# Altium schematic sheet 51-2001-01-14_04 Power Module Schematic.SchDoc
size 431 x 279 mm; Organization: ORGANIZATION; Address1: ADDRESS 1; Address2: ADDRESS 2; Address3: ADDRESS 3; Address4: ADDRESS 4; Revision: -; SheetNumber: 4; SheetTotal: 4; ENG_APP_DATE: --/--/--; DSN_APP_DATE: --/--/--; CHK_APP_DATE: --/--/--
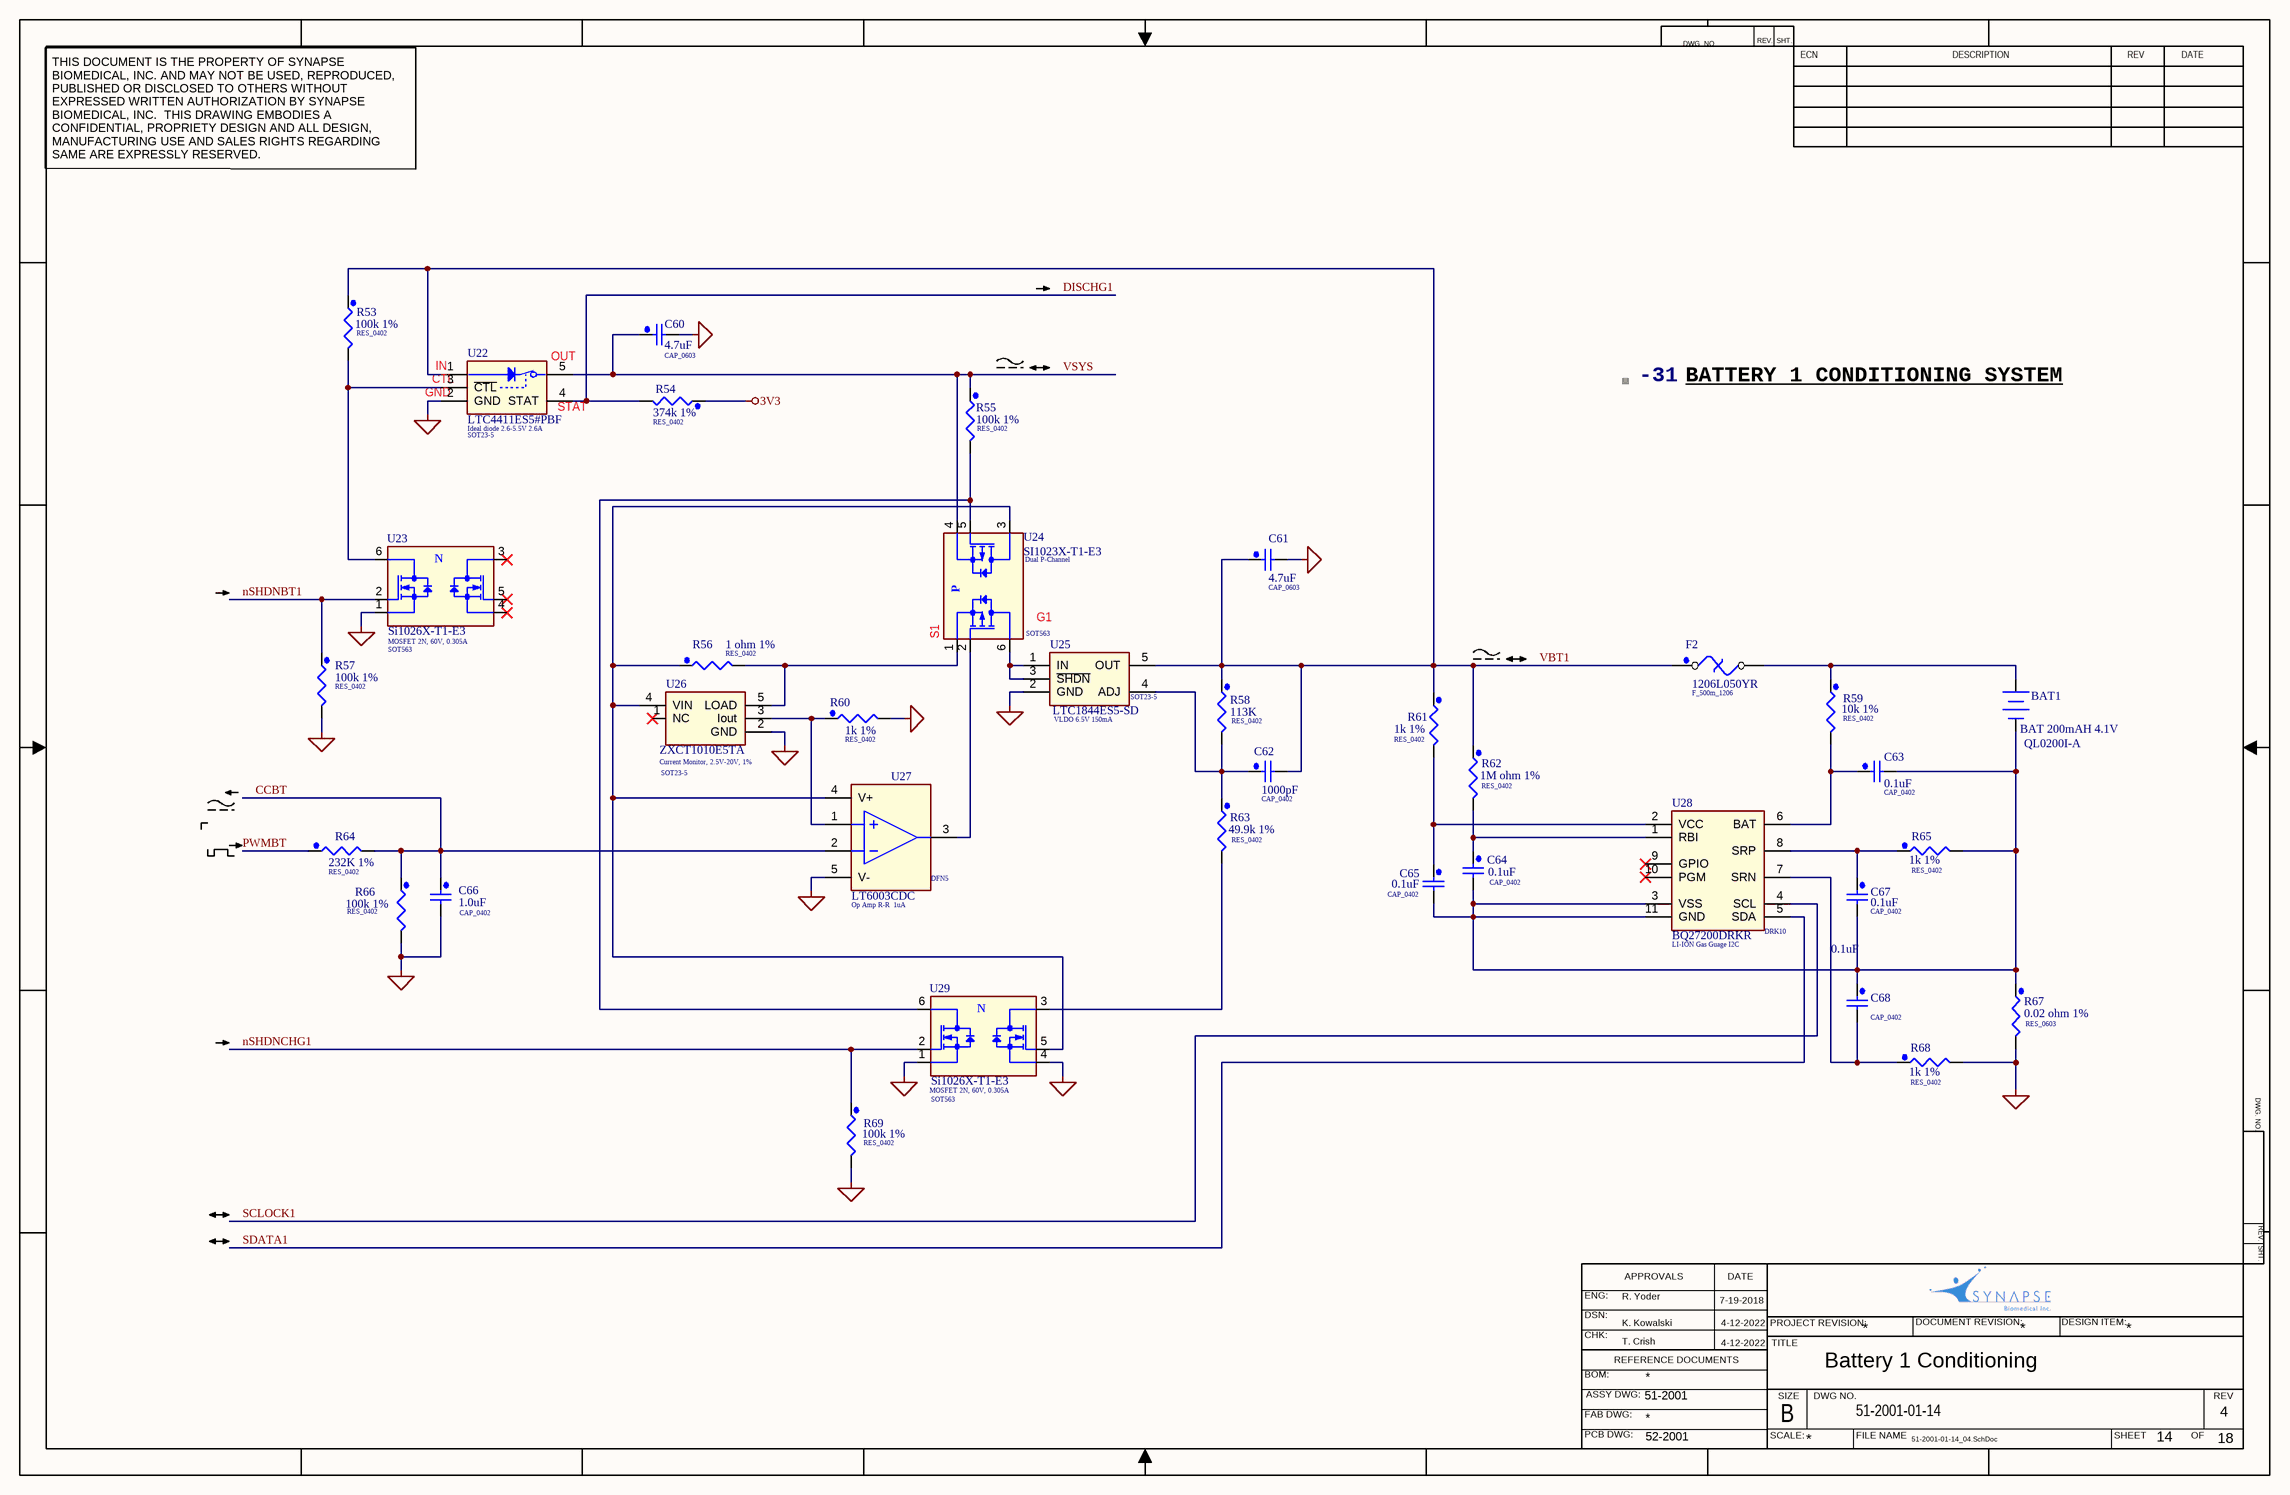
[diagram p0: 51-2001-01-14_04 Power Module Schematic.SchDoc]

## Parts
-31  XDESCRIPTION: BATTERY 1 CONDITIONING SYSTEM  (hidden comment: BOM_S1)  (graphical)
BAT1  BAT 200mAH 4.1V  [QL0200I-A]  (no BOM)
C60  value 4.7uF  [CAP_0603]  (hidden comment: C_4u7_X5R_10_0603_10%)
C61  value 4.7uF  [CAP_0603]  (hidden comment: C_4u7_X5R_10_0603_10%)
C62  value 1000pF  [CAP_0402]  (hidden comment: C_1n_C0G_50_0402_5%)
C63  value 0.1uF  [CAP_0402]  (hidden comment: C_100n_X7R_16_0402_10%)
C64  value 0.1uF  [CAP_0402]  (hidden comment: C_100n_X7R_16_0402_10%)
C65  value 0.1uF  [CAP_0402]  (hidden comment: C_100n_X7R_16_0402_10%)
C66  value 1.0uF  [CAP_0402]  (hidden comment: C_1u_X5R_6V3_0402_20%)
C67  value 0.1uF  [CAP_0402]  (hidden comment: C_100n_X7R_16_0402_10%)
C68  value 0.1uF  [CAP_0402]  (hidden comment: C_100n_X7R_16_0402_10%)
F2  F_500m_1206  [FUSE_1206]
R53  value 100k 1%  [RES_0402]  (hidden comment: R_100k_0402)
R54  value 374k 1%  [RES_0402]  (hidden comment: R_374k_0402)
R55  value 100k 1%  [RES_0402]  (hidden comment: R_100k_0402)
R56  value 1 ohm 1%  [RES_0402]  (hidden comment: R_1_0402)
R57  value 100k 1%  [RES_0402]  (hidden comment: R_100k_0402)
R58  value 113K  [RES_0402]  (hidden comment: R_113k_0402)
R59  value 10k 1%  [RES_0402]  (hidden comment: R_10k_0402)
R60  value 1k 1%  [RES_0402]  (hidden comment: R_1k_0402)
R61  value 1k 1%  [RES_0402]  (hidden comment: R_1k_0402)
R62  value 1M ohm 1%  [RES_0402]  (hidden comment: RES_0402)
R63  value 49.9k 1%  [RES_0402]  (hidden comment: R_49k9_0402)
R64  value 232K 1%  [RES_0402]  (hidden comment: R_232k_0402)
R65  value 1k 1%  [RES_0402]  (hidden comment: R_1k_0402)
R66  value 100k 1%  [RES_0402]  (hidden comment: R_100k_0402)
R67  value 0.02 ohm 1%  [RES_0603]  (hidden comment: R_20m_0603)
R68  value 1k 1%  [RES_0402]  (hidden comment: R_1k_0402)
R69  value 100k 1%  [RES_0402]  (hidden comment: R_100k_0402)
U22  Ideal diode 2.6-5.5V 2.6A  MPN: LTC4411ES5#PBF  [SOT23-5]
U23  MOSFET 2N, 60V, 0.305A  PackageDescription: SOT563  [SOT-563]
U24  Dual P-Channel  PackageDescription: SOT563  [SOT-563]
U25  VLDO 6.5V 150mA  [SOT23-5]
U26  Current Monitor, 2.5V-20V, 1%  [SOT23-5]
U27  Op Amp R-R  1uA  PackageDescription: DFN5  [DFN4]
U28  LI-ION Gas Guage I2C  PackageDescription: DRK10  [QFN10]
U29  MOSFET 2N, 60V, 0.305A  PackageDescription: SOT563  [SOT-563]

## Nets
3V3: R54.1
GND: C60.2 C61.2 C66.2 R57.2 R60.2 R66.2 R67.2 R68.2 R69.2 U22.2(GND) U23.1(S1) U25.2(GND) U26.2(GND) U27.5(V-) U29.1(S1) U29.4(S2)
CCBT: C66.1 R64.2 R66.1 U27.2(-IN)
DISCHG1: R54.2 U22.4(STAT)
nSHDNBT1: R57.1 U23.2(G1)
nSHDNCHG1: R69.1 U29.2(G1)
PWMBT: R64.1
SCLOCK1: U28.4(SCL)
SDATA1: U28.5(SDA)
VBT1: C61.1 C62.2 F2.1 R53.1 R58.1 R61.1 R62.1 U22.1(IN) U25.5(OUT)
VSYS: C60.1 R55.1 U22.5(OUT) U24.4(S2)
NetBAT1_1: BAT1.1(+) F2.2 R59.1
NetBAT1_2: BAT1.2(-) C63.2 C64.2 C65.2 C67.2 C68.1 R65.2 R67.1 U28.3(VSS) U28.11(GND)
NetC62_1: C62.1 R58.2 R63.1 U25.4(ADJ)
NetC63_1: C63.1 R59.2 U28.6(BAT)
NetC64_1: C64.1 R62.2 U28.1(RBI)
NetC65_1: C65.1 R61.2 U28.2(VCC)
NetC67_1: C67.1 R65.1 U28.8(SRP)
NetC68_2: C68.2 R68.1 U28.7(SRN)
NetR53_2: R53.2 U22.3(~{CTL}) U23.6(D1)
NetR55_2: R55.2 U24.5(G2) U29.6(D1)
NetR56_1: R56.1 U24.3(D2) U26.4(VIN) U27.4(V+) U29.5(G2)
NetR56_2: R56.2 U24.1(S1) U26.5(LOAD)
NetR60_1: R60.1 U26.3(Iout) U27.1(+IN)
NetR63_2: R63.2 U29.3(D2)
NetU24_2: U24.2(G1) U27.3(OUT_A)
NetU24_6: U24.6(D1) U25.1(IN) U25.3(~{SHDN})

Not connected (* = marked no-connect by the designer): U23 3(D2)* 4(S2)* 5(G2)*; U26 1(NC)*; U28 9(GPIO)* 10(PGM)*

## Notes on the sheet
- DWG. NO.
- REV.
- SHT.
- ECN
- DESCRIPTION
- REV
- DATE
- THIS DOCUMENT IS THE PROPERTY OF SYNAPSE BIOMEDICAL, INC. AND MAY NOT BE USED, REPRODUCED, PUBLISHED OR DISCLOSED TO OTHERS WITHOUT EXPRESSED WRITTEN AUTHORIZATION BY SYNAPSE BIOMEDICAL, INC.  THIS DRAWING EMBODIES A CONFIDENTIAL, PROPRIETY DESIGN AND ALL DESIGN, MANUFACTURING USE AND SALES RIGHTS REGARDING SAME ARE EXPRESSLY RESERVED.
- (near U22) IN
- (near U22) OUT
- (near U22) GND
- (near U22) CTL
- (near U22) STAT
- (near U24) S1
- G1
- ENG:
- R. Yoder
- APPROVALS
- 7-19-2018
- DSN:
- CHK:
- REFERENCE DOCUMENTS
- K. Kowalski
- T. Crish
- 4-12-2022
- PROJECT REVISION:
- TITLE
- Battery 1 Conditioning
- *
- DOCUMENT REVISION:
- DESIGN ITEM:
- BOM:
- FAB DWG:
- PCB DWG:
- ASSY DWG:
- 51-2001
- SCALE:
- SIZE
- B
- DWG NO.
- 51-2001-01-14
- FILE NAME
- SHEET
- OF
- 4
- 52-2001
- 51-2001-01-14_04.SchDoc
- 14
- 18
- (in symbol SI1023X-T1-E3) P
- (in symbol Si1026X-T1-E3) N

## Library data of the parts
-31 = BOM_S1: BOM item small graphic
BAT1 = QL0200I-A: Li-ion battery 200mAH 4.1V; MFR: Quallion; Value: 200mAH 4.1V; Supplier 1: Quallion; Supplier Part Number 1: QL0200I-A; MPN: QL0200I-A
C60 C61 = LMK107BJ475KA-T: 4.7uF, 10V, X5R, 10%, 0603, RoHS; MFR: Murata Electronics North America; MPN: GRM185R61A475KE11D; SBI: 53-0076; PackageDescription: CAP_0603; Supplier 1: Digi-Key; Supplier Part Number 1: 490-11988-6-ND
C62 = GRM1555C1H102JA01D: 1000pF, 50V, C0G, 5%, 0402, RoHS; MFR: Murata; SBI: 53-0041-2; PackageDescription: CAP_0402; Supplier 1: Digi-Key; Supplier Part Number 1: 490-3244-1-ND; MPN: GRM1555C1H102JA01D
C63-C65 C67 C68 = GRM155R71C104KA88D: 0.1uF, 16V, X7R, 0402, RoHS; MFR: Murata; SBI: 53-0040-1; PackageDescription: CAP_0402; Supplier 1: Digi-Key; Supplier Part Number 1: 490-3261-2-ND; MPN: GRM155R71C104KA88D
C66 = ECJ-0EB0J105M: 1.0uF, 6.3V, X5R, 20%, 0402, RoHS; MFR: Murata Electronics North America; MPN: GRM152R60J105ME15D; SBI: 53-0078; PackageDescription: CAP_0402; Supplier 1: Digi-Key; Supplier Part Number 1: 490-10006-6-ND
F2 = 1206L050YR: PTC Resettable, 500mA, 0.4 ohm,  6V, 1206, RoHS; MFR: Littelfuse; SBI: 54-0113; PackageDescription: F_500m_1206; Supplier 1: Digi-Key; Supplier Part Number 1: F2112CT-ND; Value: 500mA; MPN: 1206L050YR
R53 R55 R57 R66 R69 = MCR01MZPF1003: 100k ohm, 1%, 1/16W, smd, 0402, RoHS; MFR: Vishay Dale; MPN: CRCW0402100KFKED; SBI: 53-0049-7; PackageDescription: RES_0402; Supplier 1: Digi-Key; Supplier Part Number 1: 541-100KLDKR-ND
R54 = CRCW0402374KFKED: 374k ohm, 1%, 1/16W, 0402,RoHS; MFR: Vishay Dale; SBI: 53-0049-25; PackageDescription: RES_0402; Supplier 1: Digi-Key; Supplier Part Number 1: 541-374KLDKR-ND; MPN: CRCW0402374KFKED
R56 = CRCW04021R00FNED: 1.0 ohm, 1%, 1/16W, 0402, RoHS; MFR: Vishay; PackageDescription: RES_0402; Supplier 1: Digi-Key; Supplier Part Number 1: 541-1.00LCT-ND; MPN: CRCW04021R00FNED
R58 = ERJ-2RKF1133X: 113k ohm, 1%, 1/16W, 0402, RoHS; MFR: Vishay Dale; MPN: CRCW0402113KFKED; SBI: 53-0049-33; PackageDescription: RES_0402; Supplier 1: Digi-Key; Supplier Part Number 1: 541-113KLDKR-ND
R59 = MCR01MZPF1002: 10.0k ohm, 1%, 1/16W, smd, 0402, RoHS; MFR: Vishay Dale; MPN: CRCW040210K0FKED; PackageDescription: RES_0402; Supplier 1: Digi-Key; Supplier Part Number 1: 541-10.0KLDKR-ND
R60 R61 R65 R68 = MCR01MZPF1001: 1.0k ohm 1% 1/16W smd 0402 RoHS; MFR: Vishay Dale; MPN: CRCW04021K00FKED; SBI: 53-0049-4; PackageDescription: RES_0402; Supplier 1: Digi-Key; Supplier Part Number 1: 541-1.00KLDKR-ND
R62 = MCR01MZPF1004: 1M ohm, 1/16W, 1%, 0402, RoHS; MFR: Vishay Dale; MPN: CRCW04021M00FKED; SBI: 53-0095; PackageDescription: RES_0402; Supplier 1: Digi-Key; Supplier Part Number 1: 541-1.00MLDKR-ND
R63 = MCR01MZPF4992: 49.9k ohm, 1%, 1/16W, 0402, RoHS; MFR: Vishay Dale; MPN: CRCW040249K9FKED; SBI: 53-009-2; PackageDescription: RES_0402; Supplier 1: Digi-Key; Supplier Part Number 1: 541-49.9KLDKR-ND
R64 = CRCW0402232KFKED: 232k, 1%, 1/16W, 0402, RoHS; MFR: Vishay Dale; SBI: 53-0049-34; PackageDescription: RES_0402; Supplier 1: Digi-Key; Supplier Part Number 1: 541-232KLDKR-ND; MPN: CRCW0402232KFKED
R67 = WSL0603R0200FEA: 0.02 ohm, 1%, 1/10W, 0603, RoHS; MFR: Vishay Dale; SBI: 53-0087; PackageDescription: RES_0603; Supplier 1: Digi-Key; Supplier Part Number 1: WSLJ-.02DKR-ND; MPN: WSL0603R0200FEA
U22 = LTC4411ES5: Ideal diode, 2.6-5.5V, 2.6A, SOT23-5, RoHS; MFR: Linear Technology; SBI: 54-0101; Supplier 1: Digi-Key; Supplier Part Number 1: LTC4411ES5#TRMPBFDKR-ND; PackageDescription: SOT23-5
U23 U29 = Si1026X-T1-E3: MOSFET 2N, 60V, 0.305A, RoHS; MFR: Vishay Siliconix; Value: 500mA; SBI: 54-0102; Supplier 1: Digi-Key; Supplier Part Number 1: SI1026X-T1-E3CT-ND; MPN: Si1026X-T1-E3
U24 = SI1023X-T1-E3: Dual P-Channel Mosfet, SOT563, RoHS; MFR: Vishay Siliconix; Value: -350mA; SBI: 54-0103; Supplier 1: Digi-Key; Supplier Part Number 1: SI1023X-T1-GE3CT-ND; MPN: SI1023X-T1-E3
U25 = LTC1844ES5-SD: VLDO, 150mA, SOT23-5, RoHS; MFR: Linear Technology; SBI: 54-0104; Supplier 1: Digi-Key; Supplier Part Number 1: LTC1844ES5-SD#TRMPBFDKR-ND; PackageDescription: SOT23-5; Value: 150mA; MPN: LTC1844ES5-SD
U26 = ZXCT1010E5TA: Current Monitor, 2.5V-20V, 1%, RoHS; MFR: Diodes Incorporated; SBI: 54-0052; ComponentLink1URL: Q:\00\04\00-04-3500 Zetex ZXCT1010.pdf; ComponentNNPS_PN: 00-04-3500; PackageDescription: SOT23-5; Supplier 1: Digi-Key; Supplier Part Number 1: ZXCT1010DKR-ND; Value: ZXCT1010; MPN: ZXCT1010E5TA
U27 = LT6003CDC: Op Amp, R-R, 1uA, RoHS; MFR: Linear Technology; SBI: 54-0105; Supplier 1: Digi-Key; Supplier Part Number 1: LT6003CDC#TRMPBFDKR-ND; MPN: LT6003CDC; Manufacturer: Linear Technology; ManufacturerPN: LT6003CDC
U28 = BQ27200DRKR: LI-ION Gas Guage, I2C, QFN10, RoHS; MFR: Texas Instruments; SBI: 54-0106; Supplier 1: Digi-Key; Supplier Part Number 1: 296-17521-6-ND; MPN: BQ27200DRKR